# Altium schematic sheet [01]POWER.SchDoc
size C
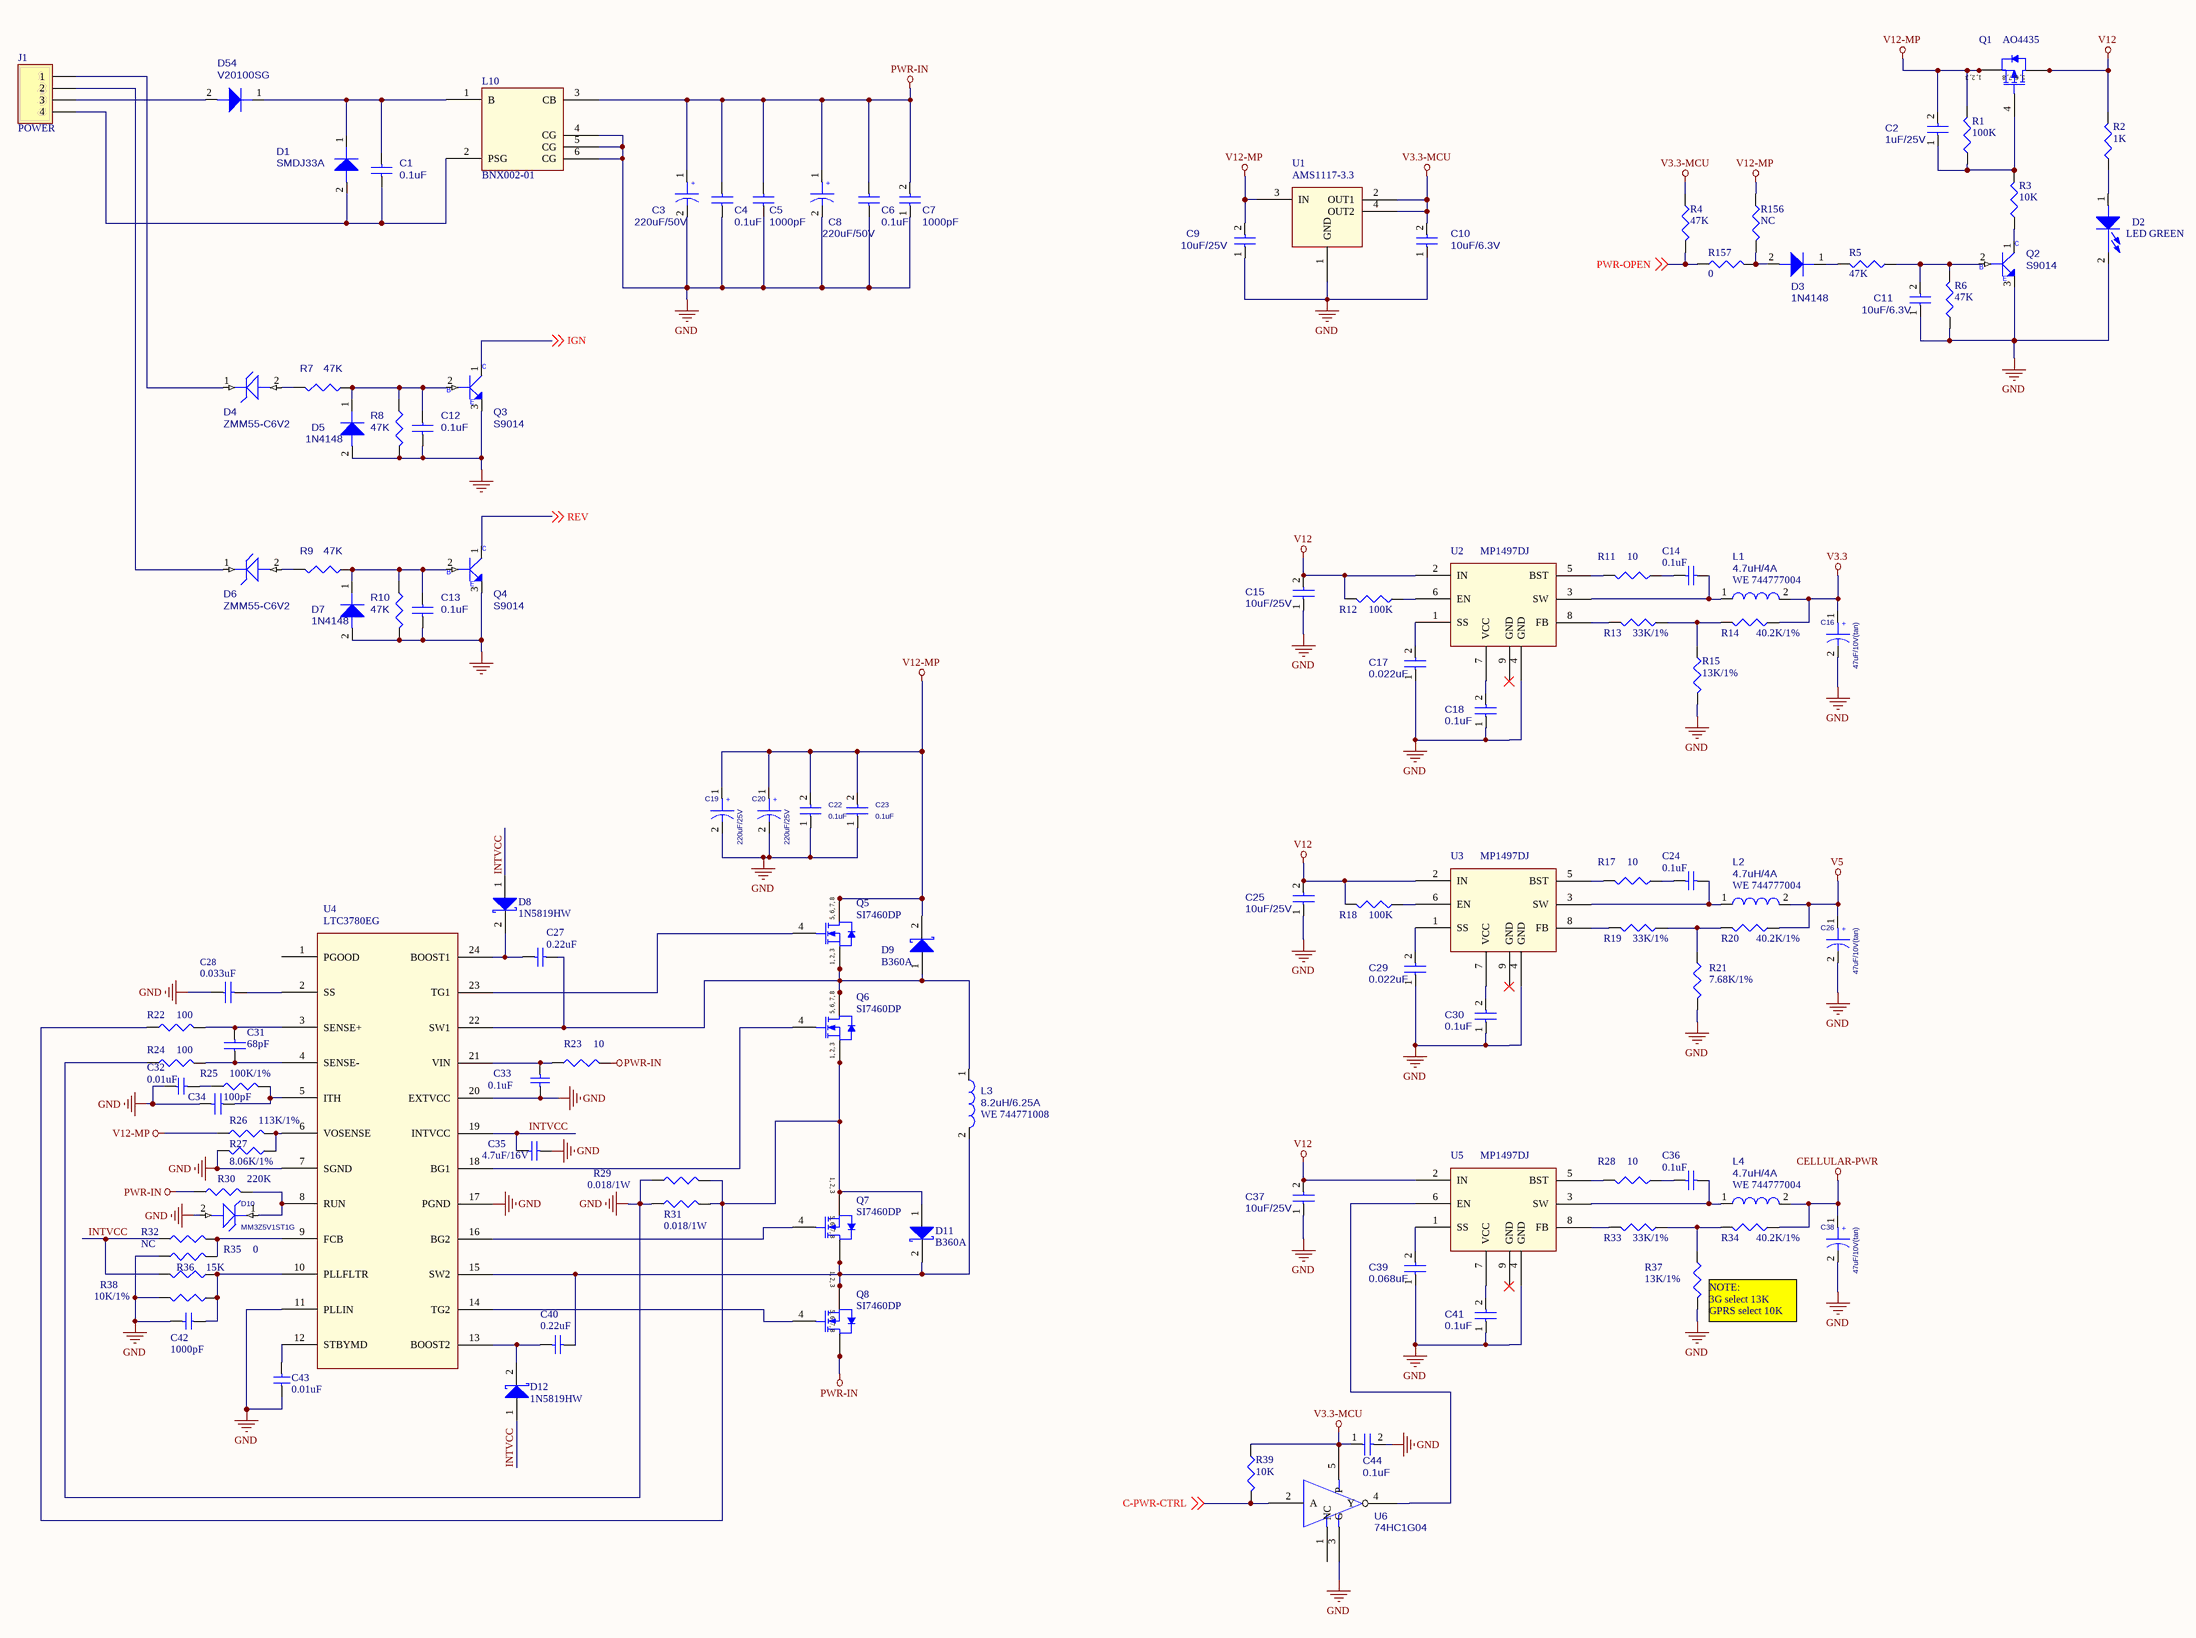
[diagram p0: [01]POWER.SchDoc]

## Parts
C1  0.1uF  [0603]
C2  1uF/25V  [0805]
C3  220uF/50V  [DL-10*10.5]
C4  0.1uF  [0603]
C5  1000pF  [0603]
C6  0.1uF  [0603]
C7  1000pF  [0603]
C8  220uF/50V  [DL-10*10.5]
C9  10uF/25V  [1812]
C10  10uF/6.3V  [0805]
C11  10uF/6.3V  [0805]
C12  0.1uF  [0603]
C13  0.1uF  [0603]
C14  0.1uF  [0603]
C15  10uF/25V  [1812]
C16  47uF/10V(tan)  [3528]
C17  0.022uF  [0603]
C18  0.1uF  [0603]
C19  220uF/25V  [DL-8*10.5]
C20  220uF/25V  [DL-8*10.5]
C22  0.1uF  [0603]
C23  0.1uF  [0603]
C24  0.1uF  [0603]
C25  10uF/25V  [1812]
C26  47uF/10V(tan)  [3528]
C27  0.22uF  [0603]
C28  0.033uF  [0603]
C29  0.022uF  [0603]
C30  0.1uF  [0603]
C31  68pF  [0603]
C32  0.01uF  [0603]
C33  0.1uF  [0603]
C34  100pF  [0603]
C35  4.7uF/16V  [0805]
C36  0.1uF  [0603]
C37  10uF/25V  [1812]
C38  47uF/10V(tan)  [3528]
C39  0.068uF  [0603]
C40  0.22uF  [0603]
C41  0.1uF  [0603]
C42  1000pF  [0603]
C43  0.01uF  [0603]
C44  0.1uF  [0603]
D1  SMDJ33A  [DO214AB]
D2  LED GREEN  [LED0603]
D3  1N4148  [MINI-MELF]
D4  ZMM55-C6V2  [MINI-MELF]
D5  1N4148  [MINI-MELF]
D6  ZMM55-C6V2  [MINI-MELF]
D7  1N4148  [MINI-MELF]
D8  1N5819HW  [1N5819]
D9  B360A  [B320A]
D10  MM3Z5V1ST1G  [MM3Z5V1ST1G]
D11  B360A  [B320A]
D12  1N5819HW  [1N5819]
D54  V20100SG  [V20100SG]
J1  POWER  [5557-4PIN]
L1  4.7uH/4A  code: WE 744777004  [IND-4.7UH-4A]
L2  4.7uH/4A  code: WE 744777004  [IND-4.7UH-4A]
L3  8.2uH/6.25A  code: WE 744771008  [IND-8.2UH-10A]
L4  4.7uH/4A  code: WE 744777004  [IND-4.7UH-4A]
L10  BNX002-01  [BNX002-001]
Q1  AO4435  [SO8]
Q2  S9014  [NPN]
Q3  S9014  [NPN]
Q4  S9014  [NPN]
Q5  SI7460DP  [POWERPAK]
Q6  SI7460DP  [POWERPAK]
Q7  SI7460DP  [POWERPAK]
Q8  SI7460DP  [POWERPAK]
R1  100K  [0603]
R2  1K  [0603]
R3  10K  [0603]
R4  47K  [0603]
R5  47K  [0603]
R6  47K  [0603]
R7  47K  [0603]
R8  47K  [0603]
R9  47K  [0603]
R10  47K  [0603]
R11  10  [0603]
R12  100K  [0603]
R13  33K/1%  [0603]
R14  40.2K/1%  [0603]
R15  13K/1%  [0603]
R17  10  [0603]
R18  100K  [0603]
R19  33K/1%  [0603]
R20  40.2K/1%  [0603]
R21  7.68K/1%  [0603]
R22  100  [0603]
R23  10  [0805]
R24  100  [0603]
R25  100K/1%  [0603]
R26  113K/1%  [0603]
R27  8.06K/1%  [0603]
R28  10  [0603]
R29  0.018/1W  [2512]
R30  220K  [0603]
R31  0.018/1W  [2512]
R32  NC  [0603]
R33  33K/1%  [0603]
R34  40.2K/1%  [0603]
R35  0  [0603]
R36  15K  [0603]
R37  13K/1%  [0603]
R38  10K/1%  [0603]
R39  10K  [0603]
R156  NC  [0603]
R157  0  [0603]
U1  AMS1117-3.3  [AMS1117]
U2  MP1497DJ  [TSOT23-8]
U3  MP1497DJ  [TSOT23-8]
U4  LTC3780EG  [LTC3780EG]
U5  MP1497DJ  [TSOT23-8]
U6  74HC1G04  [SOT753]

## Nets
CELLULAR-PWR: C38.1 L4.2 R34.1
GND: C3.2 C4.1 C5.1 C6.1 C7.1 C8.2 C9.1 C10.1 C11.1 C12.2 C13.2 C15.1 C16.2 C17.1 C18.1 C19.2 C20.2 C22.1 C23.1 C25.1 C26.2 C28.1 C29.1 C30.1 C32.1 C33.1 C34.2 C35.2 C37.1 C38.2 C39.1 C41.1 C42.2 C43.1 C44.2 D2.2(CATHODE) D5.2 D7.2 D10.2 L10.4(CG) L10.5(CG) L10.6(CG) Q2.3(EMITTER) Q3.3(EMITTER) Q4.3(EMITTER) R6.1 R8.2 R10.2 R15.2 R21.2 R24.1 R27.2 R29.1 R31.1 R35.1 R37.2 R38.2 U1.1(GND) U2.4(GND) U3.4(GND) U4.7(SGND) U4.11(PLLIN) U4.17(PGND) U4.20(EXTVCC) U5.4(GND) U6.3(G)
PWR-IN: C3.1 C4.2 C5.2 C6.2 C7.2 C8.1 L10.3(CB) Q8.5(D) Q8.6(D) Q8.7(D) Q8.8(D) R23.2 R30.1
V3.3: C16.1 L1.2 R14.1
V3.3-MCU: C10.2 C44.1 R4.1 R39.1 U1.2(OUT1) U1.4(OUT2) U6.5(P)
V5: C26.1 L2.2 R20.1
V12: C15.2 C25.2 C37.2 Q1.5(D) Q1.6(D) Q1.7(D) Q1.8(D) R2.2 R12.2 R18.2 U2.2(IN) U3.2(IN) U5.2(IN)
V12-MP: C2.2 C9.2 C19.1 C20.1 C22.2 C23.2 D9.2(K) Q1.1(S) Q1.2(S) Q1.3(S) Q5.5(D) Q5.6(D) Q5.7(D) Q5.8(D) R1.2 R26.1 R156.1 U1.3(IN)
C-PWR-CTRL: R39.2 U6.2(A) ; off-sheet C-PWR-CTRL
IGN: Q3.1(COLLECTOR) ; off-sheet IGN
INTVCC: C35.1 D8.1(A) D12.1(A) R32.1 R36.2 U4.19(INTVCC)
PWR-OPEN: R4.2 R157.1 ; off-sheet PWR-OPEN
REV: Q4.1(COLLECTOR) ; off-sheet REV
NetC1_1: C1.1 D1.2 J1.4 L10.2(PSG)
NetC1_2: C1.2 D1.1 D54.1 L10.1(B)
NetC2_1: C2.1 Q1.4(G) R1.1 R3.2
NetC11_2: C11.2 Q2.2(BASE) R5.1 R6.2
NetC12_1: C12.1 D5.1 Q3.2(BASE) R7.1 R8.1
NetC13_1: C13.1 D7.1 Q4.2(BASE) R9.1 R10.1
NetC14_1: C14.1 L1.1 U2.3(SW)
NetC14_2: C14.2 R11.1
NetC17_2: C17.2 U2.1(SS)
NetC18_2: C18.2 U2.7(VCC)
NetC24_1: C24.1 L2.1 U3.3(SW)
NetC24_2: C24.2 R17.1
NetC27_1: C27.1 D9.1(A) L3.1 Q5.1(S) Q5.2(S) Q5.3(S) Q6.5(D) Q6.6(D) Q6.7(D) Q6.8(D) U4.22(SW1)
NetC27_2: C27.2 D8.2(K) U4.24(BOOST1)
NetC28_2: C28.2 U4.2(SS)
NetC29_2: C29.2 U3.1(SS)
NetC30_2: C30.2 U3.7(VCC)
NetC31_1: C31.1 R24.2 U4.4(SENSE-)
NetC31_2: C31.2 R22.2 U4.3(SENSE+)
NetC32_2: C32.2 R25.1
NetC33_2: C33.2 R23.1 U4.21(VIN)
NetC34_1: C34.1 R25.2 U4.5(ITH)
NetC36_1: C36.1 L4.1 U5.3(SW)
NetC36_2: C36.2 R28.1
NetC39_2: C39.2 U5.1(SS)
NetC40_1: C40.1 D11.2(K) L3.2 Q7.5(D) Q7.6(D) Q7.7(D) Q7.8(D) Q8.1(S) Q8.2(S) Q8.3(S) U4.15(SW2)
NetC40_2: C40.2 D12.2(K) U4.13(BOOST2)
NetC41_2: C41.2 U5.7(VCC)
NetC42_1: C42.1 R36.1 R38.1 U4.10(PLLFLTR)
NetC43_2: C43.2 U4.12(STBYMD)
NetD2_1: D2.1(ANODE) R2.1
NetD3_1: D3.1 R5.2
NetD3_2: D3.2 R156.2 R157.2
NetD4_1: D4.1 J1.1
NetD4_2: D4.2 R7.2
NetD6_1: D6.1 J1.2
NetD6_2: D6.2 R9.2
NetD10_1: D10.1 R30.2 U4.8(RUN)
NetD11_1: D11.1(A) Q6.1(S) Q6.2(S) Q6.3(S) Q7.1(S) Q7.2(S) Q7.3(S) R22.1 R29.2 R31.2
NetD54_2: D54.2 J1.3
NetQ2_1: Q2.1(COLLECTOR) R3.1
NetQ5_4: Q5.4(G) U4.23(TG1)
NetQ6_4: Q6.4(G) U4.18(BG1)
NetQ7_4: Q7.4(G) U4.16(BG2)
NetQ8_4: Q8.4(G) U4.14(TG2)
NetR11_2: R11.2 U2.5(BST)
NetR12_1: R12.1 U2.6(EN)
NetR13_1: R13.1 R14.2 R15.1
NetR13_2: R13.2 U2.8(FB)
NetR17_2: R17.2 U3.5(BST)
NetR18_1: R18.1 U3.6(EN)
NetR19_1: R19.1 R20.2 R21.1
NetR19_2: R19.2 U3.8(FB)
NetR26_2: R26.2 R27.1 U4.6(VOSENSE)
NetR28_2: R28.2 U5.5(BST)
NetR32_2: R32.2 R35.2 U4.9(FCB)
NetR33_1: R33.1 R34.2 R37.1
NetR33_2: R33.2 U5.8(FB)
NetU5_6: U5.6(EN) U6.4(Y)

Not connected (* = marked no-connect by the designer): U2 9(GND)*; U3 9(GND)*; U4 1(PGOOD); U5 9(GND)*; U6 1(NC)

## Notes on the sheet
- (near R37) NOTE:
  3G select 13K
  GPRS select 10K
- (in symbol CAP WP) +
- (in symbol MMBT3904_NL_SOT23-3) C; B; E
- (in symbol SI4410DY) 1, 2, 3; 5, 6, 7, 8
- (in symbol SI4431DY) 1, 2, 3; 5, 6, 7, 8

## Library data of the parts
C1 C2 C4-C7 C9-C11 C15 C17 C18 C22 C23 C25 C29 C30 C37 C39 C41 C44 = CAP NP_Dup2
C3 C8 C16 C19 C20 C26 C38 = CAP WP
C12 C13 = CAP
C14 C24 C27 C33 C35 C36 C40 = Cap: Capacitor
C28 C31 = 06033C223KAT1A_0
C32 = 06033C103KAT2A
C34 = 06035A470KAT1A_0
C42 C43 = 06033C103KAT2A_0
D1 D3 D5 D7 D54 = 1N4148WS-7-F_SOD323-2
D2 = LN01401_1
D4 D6 D10 = MMGZ5231BPTLL34
D8 D9 D11 D12 = Diode 11DQ03: Schottky Rectifier
J1 = Header 4: Header, 4-Pin
L1-L4 = 4.7UH_CDH2D09BNP-4R7MC_0.7A_20%
Q1 = SI4431DY: P-Channel 30V (D-S)  MOSFET; Published: 8-Jun-2000; LatestRevisionDate: 13-Apr-2006; LatestRevisionNote: IPC-7351 Footprint Added.; DatasheetVersion: 6-Oct-1997; PackageVersion: Aug-1998; PackageReference: SO-8; Publisher: Altium Limited; PackageDescription: 8-Pin Small Outline Integrated Circuit 1.27 mm Pitch; ComponentLink1Description: Manufacturer Link; ComponentLink1URL: http://www.vishay.com/; ComponentLink2Description: Datasheet; ComponentLink2URL: http://www.vishay.com/docs/70151/70151.pdf
Q2 Q3 = MMBT3904_NL_SOT23-3: Part Description: S TR MMBT3904_NL NPN SOT23; Part Number: SB039040000
Q4 = MMBT3904_NL_SOT23-3
Q5-Q8 = SI4410DY: N-Channel 30V (D-S)  MOSFET
R1-R6 R11-R15 R17-R21 R23 R25 R28 R29 R31-R39 R156 R157 = CR16-1003FM
R7-R10 = R
R22 R24 = CR16-1241FM
R26 = CR16-1133FM
R27 = CR16-8061FM
R30 = CR16-224JM
U1 = LT1963EST-1_4.8
U2 U3 U5 = MP1482_5
U6 = 74LVC1G04GW_SOT353-5: Part  Number: SA00000FX00